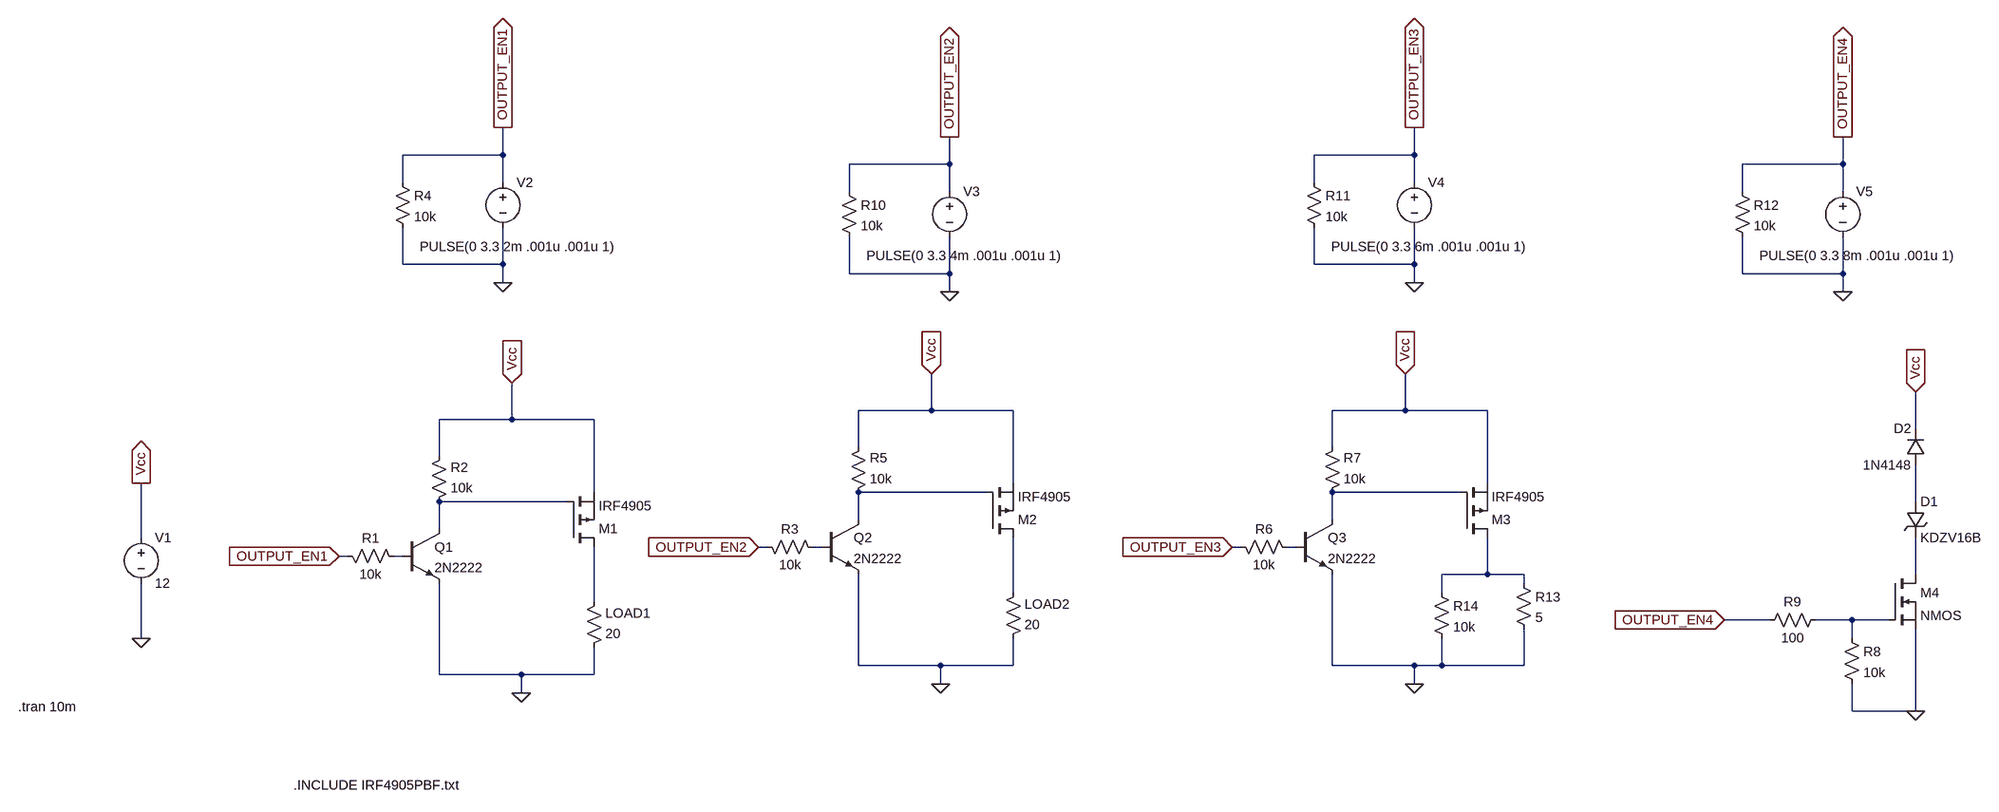
[diagram p0: schematic output_ckt2.asc]
output_ckt2.asc, the LTspice schematic file:
Version 4
SHEET 1 3256 680
WIRE 480 -608 480 -656
WIRE 480 -608 304 -608
WIRE 2080 -608 2080 -656
WIRE 2080 -608 1904 -608
WIRE 1264 -592 1264 -640
WIRE 1264 -592 1088 -592
WIRE 2832 -592 2832 -640
WIRE 2832 -592 2656 -592
WIRE 304 -560 304 -608
WIRE 480 -560 480 -608
WIRE 1904 -560 1904 -608
WIRE 2080 -560 2080 -608
WIRE 1088 -544 1088 -592
WIRE 1264 -544 1264 -592
WIRE 2656 -544 2656 -592
WIRE 2832 -544 2832 -592
WIRE 304 -416 304 -480
WIRE 480 -416 480 -480
WIRE 480 -416 304 -416
WIRE 1904 -416 1904 -480
WIRE 2080 -416 2080 -480
WIRE 2080 -416 1904 -416
WIRE 1088 -400 1088 -464
WIRE 1264 -400 1264 -464
WIRE 1264 -400 1088 -400
WIRE 2656 -400 2656 -464
WIRE 2832 -400 2832 -464
WIRE 2832 -400 2656 -400
WIRE 480 -384 480 -416
WIRE 2080 -384 2080 -416
WIRE 1264 -368 1264 -400
WIRE 2832 -368 2832 -400
WIRE 1232 -160 1232 -224
WIRE 1232 -160 1104 -160
WIRE 1376 -160 1232 -160
WIRE 2064 -160 2064 -224
WIRE 2064 -160 1936 -160
WIRE 2208 -160 2064 -160
WIRE 496 -144 496 -208
WIRE 496 -144 368 -144
WIRE 640 -144 496 -144
WIRE 2960 -128 2960 -192
WIRE 1104 -96 1104 -160
WIRE 1936 -96 1936 -160
WIRE 368 -80 368 -144
WIRE 1376 -32 1376 -160
WIRE 2208 -32 2208 -160
WIRE 640 -16 640 -144
WIRE 1328 -16 1104 -16
WIRE 2160 -16 1936 -16
WIRE 592 0 368 0
WIRE 2960 0 2960 -64
WIRE 1104 32 1104 -16
WIRE 1936 32 1936 -16
WIRE 368 48 368 0
WIRE -320 64 -320 -32
WIRE 944 80 928 80
WIRE 1040 80 1024 80
WIRE 1776 80 1760 80
WIRE 1872 80 1856 80
WIRE 208 96 192 96
WIRE 304 96 288 96
WIRE 2208 128 2208 64
WIRE 2208 128 2128 128
WIRE 2272 128 2208 128
WIRE 2960 128 2960 64
WIRE 2272 144 2272 128
WIRE 1376 160 1376 64
WIRE 2128 160 2128 128
WIRE 640 176 640 80
WIRE 2704 208 2624 208
WIRE 2848 208 2784 208
WIRE 2912 208 2848 208
WIRE -320 240 -320 144
WIRE 2848 240 2848 208
WIRE 1104 288 1104 128
WIRE 1248 288 1104 288
WIRE 1376 288 1376 240
WIRE 1376 288 1248 288
WIRE 1936 288 1936 128
WIRE 2080 288 1936 288
WIRE 2128 288 2128 240
WIRE 2128 288 2080 288
WIRE 2272 288 2272 224
WIRE 2272 288 2128 288
WIRE 368 304 368 144
WIRE 512 304 368 304
WIRE 640 304 640 256
WIRE 640 304 512 304
WIRE 1248 320 1248 288
WIRE 2080 320 2080 288
WIRE 512 336 512 304
WIRE 2848 368 2848 320
WIRE 2960 368 2960 224
WIRE 2960 368 2848 368
FLAG 512 336 0
FLAG 480 -384 0
FLAG 480 -656 OUTPUT_EN1
IOPIN 480 -656 Out
FLAG -320 240 0
FLAG -320 -32 Vcc
IOPIN -320 -32 Out
FLAG 496 -208 Vcc
IOPIN 496 -208 In
FLAG 192 96 OUTPUT_EN1
IOPIN 192 96 In
FLAG 1248 320 0
FLAG 1232 -224 Vcc
IOPIN 1232 -224 In
FLAG 928 80 OUTPUT_EN2
IOPIN 928 80 In
FLAG 2080 320 0
FLAG 2064 -224 Vcc
IOPIN 2064 -224 In
FLAG 1760 80 OUTPUT_EN3
IOPIN 1760 80 In
FLAG 2960 -192 Vcc
IOPIN 2960 -192 In
FLAG 2624 208 OUTPUT_EN4
IOPIN 2624 208 In
FLAG 1264 -368 0
FLAG 1264 -640 OUTPUT_EN2
IOPIN 1264 -640 Out
FLAG 2080 -384 0
FLAG 2080 -656 OUTPUT_EN3
IOPIN 2080 -656 Out
FLAG 2832 -368 0
FLAG 2832 -640 OUTPUT_EN4
IOPIN 2832 -640 Out
FLAG 2960 368 0
SYMBOL voltage -320 48 R0
WINDOW 123 0 0 Left 0
WINDOW 39 0 0 Left 0
SYMATTR InstName V1
SYMATTR Value 12
SYMBOL res 192 80 M90
WINDOW 0 0 56 VBottom 2
WINDOW 3 32 56 VTop 2
SYMATTR InstName R1
SYMATTR Value 10k
SYMBOL res 352 16 M180
WINDOW 0 36 76 Left 2
WINDOW 3 36 40 Left 2
SYMATTR InstName R2
SYMATTR Value 10k
SYMBOL res 624 272 M180
WINDOW 0 36 76 Left 2
WINDOW 3 36 40 Left 2
SYMATTR InstName LOAD1
SYMATTR Value 20
SYMBOL npn 304 48 R0
SYMATTR InstName Q1
SYMATTR Value 2N2222
SYMBOL pmos 592 80 M180
SYMATTR InstName M1
SYMATTR Value IRF4905
SYMATTR Prefix X
SYMBOL voltage 480 -576 R0
WINDOW 3 -146 129 Left 2
WINDOW 123 0 0 Left 0
WINDOW 39 0 0 Left 0
SYMATTR Value PULSE(0 3.3 2m .001u .001u 1)
SYMATTR InstName V2
SYMBOL res 288 -576 R0
SYMATTR InstName R4
SYMATTR Value 10k
SYMBOL res 928 64 M90
WINDOW 0 0 56 VBottom 2
WINDOW 3 32 56 VTop 2
SYMATTR InstName R3
SYMATTR Value 10k
SYMBOL res 1088 0 M180
WINDOW 0 36 76 Left 2
WINDOW 3 36 40 Left 2
SYMATTR InstName R5
SYMATTR Value 10k
SYMBOL res 1360 256 M180
WINDOW 0 36 76 Left 2
WINDOW 3 36 40 Left 2
SYMATTR InstName LOAD2
SYMATTR Value 20
SYMBOL npn 1040 32 R0
SYMATTR InstName Q2
SYMATTR Value 2N2222
SYMBOL res 1760 64 M90
WINDOW 0 0 56 VBottom 2
WINDOW 3 32 56 VTop 2
SYMATTR InstName R6
SYMATTR Value 10k
SYMBOL res 1920 0 M180
WINDOW 0 36 76 Left 2
WINDOW 3 36 40 Left 2
SYMATTR InstName R7
SYMATTR Value 10k
SYMBOL npn 1872 32 R0
SYMATTR InstName Q3
SYMATTR Value 2N2222
SYMBOL voltage 1264 -560 R0
WINDOW 3 -146 129 Left 2
WINDOW 123 0 0 Left 0
WINDOW 39 0 0 Left 0
SYMATTR Value PULSE(0 3.3 4m .001u .001u 1)
SYMATTR InstName V3
SYMBOL res 1072 -560 R0
SYMATTR InstName R10
SYMATTR Value 10k
SYMBOL voltage 2080 -576 R0
WINDOW 3 -146 129 Left 2
WINDOW 123 0 0 Left 0
WINDOW 39 0 0 Left 0
SYMATTR Value PULSE(0 3.3 6m .001u .001u 1)
SYMATTR InstName V4
SYMBOL res 1888 -576 R0
SYMATTR InstName R11
SYMATTR Value 10k
SYMBOL voltage 2832 -560 R0
WINDOW 3 -146 129 Left 2
WINDOW 123 0 0 Left 0
WINDOW 39 0 0 Left 0
SYMATTR Value PULSE(0 3.3 8m .001u .001u 1)
SYMATTR InstName V5
SYMBOL res 2640 -560 R0
SYMATTR InstName R12
SYMATTR Value 10k
SYMBOL pmos 1328 64 M180
SYMATTR InstName M2
SYMATTR Value IRF4905
SYMATTR Prefix X
SYMBOL pmos 2160 64 M180
SYMATTR InstName M3
SYMATTR Value IRF4905
SYMATTR Prefix X
SYMBOL zener 2944 0 R0
SYMATTR InstName D1
SYMATTR Value KDZV16B
SYMBOL diode 2976 -64 R180
WINDOW 0 24 64 Left 2
WINDOW 3 24 0 Left 2
SYMATTR InstName D2
SYMATTR Value 1N4148
SYMBOL nmos 2912 128 R0
SYMATTR InstName M4
SYMBOL res 2832 224 R0
SYMATTR InstName R8
SYMATTR Value 10k
SYMBOL res 2800 192 R90
WINDOW 0 0 56 VBottom 2
WINDOW 3 32 56 VTop 2
SYMATTR InstName R9
SYMATTR Value 100
SYMBOL res 2256 128 R0
SYMATTR InstName R13
SYMATTR Value 5
SYMBOL res 2112 144 R0
SYMATTR InstName R14
SYMATTR Value 10k
TEXT -536 360 Left 2 !.tran 10m
TEXT 112 528 Left 2 !.INCLUDE IRF4905PBF.txt

The netlist it stands for:
* output_ckt2.asc
V1 Vcc 0 12
R1 OUTPUT_EN1 N007 10k
R2 N003 Vcc 10k
R§LOAD1 0 N011 20
Q1 N003 N007 0 0 2N2222
XM1 N011 N003 Vcc IRF4905  ; pins D G S
V2 OUTPUT_EN1 0 PULSE(0 3.3 2m .001u .001u 1)
R4 OUTPUT_EN1 0 10k
R3 OUTPUT_EN2 N005 10k
R5 N001 Vcc 10k
R§LOAD2 0 N010 20
Q2 N001 N005 0 0 2N2222
R6 OUTPUT_EN3 N006 10k
R7 N002 Vcc 10k
Q3 N002 N006 0 0 2N2222
V3 OUTPUT_EN2 0 PULSE(0 3.3 4m .001u .001u 1)
R10 OUTPUT_EN2 0 10k
V4 OUTPUT_EN3 0 PULSE(0 3.3 6m .001u .001u 1)
R11 OUTPUT_EN3 0 10k
V5 OUTPUT_EN4 0 PULSE(0 3.3 8m .001u .001u 1)
R12 OUTPUT_EN4 0 10k
XM2 N010 N001 Vcc IRF4905  ; pins D G S
XM3 N008 N002 Vcc IRF4905  ; pins D G S
D1 N004 N009 KDZV16B
D2 N004 Vcc 1N4148
M4 N009 N012 0 0 NMOS
R8 N012 0 10k
R9 N012 OUTPUT_EN4 100
R13 N008 0 5
R14 N008 0 10k
.model D D
.lib standard.dio
.model NPN NPN
.model PNP PNP
.lib standard.bjt
.model NMOS NMOS
.model PMOS PMOS
.lib standard.mos
.tran 10m
.INCLUDE IRF4905PBF.txt
.backanno
.end